# EAGLE design USB C breakout (EAGLE 9.6.2)
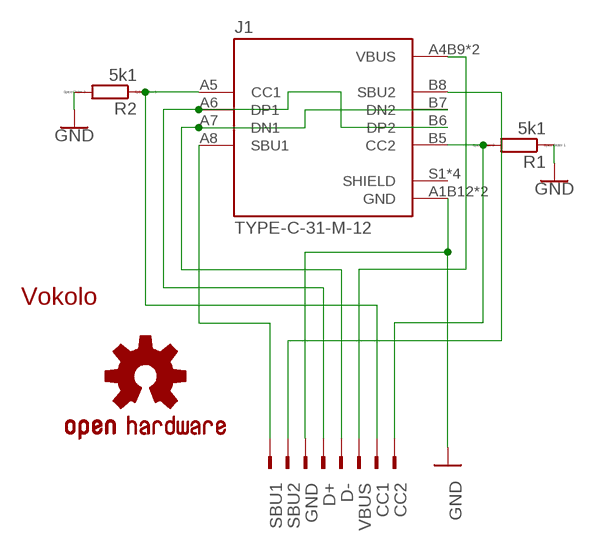
[diagram p0: schematic, sheet 1]

## Parts
J1  TYPE-C-31-M-12  [HRO_TYPE-C-31-M-12]
LOGO1  OSHW-LOGOS  [OSHW-LOGO-S]
R1  5k1  RR0603  [R0603]
R2  5k1  RR0603  [R0603]
U$1  LOGO_VOKOLO12MM  [LOGO_VOKOLO_9,8MM]
X1  TSW-108-07-G-S  [TSW-108-XX-G-S]

## Nets
CC1: J1.A5(CC1) R2.1 X1.2
CC2: J1.B5(CC2) R1.2 X1.1
D+: J1.A6(DP1) J1.B6(DP2) X1.5
D-: J1.A7(DN1) J1.B7(DN2) X1.4
GND: J1.A1B12(GND) J1.B1A12(GND) R1.1 R2.2 X1.6
SBU1: J1.A8(SBU1) X1.8
SBU2: J1.B8(SBU2) X1.7
VBUS: J1.A4B9(VBUS) J1.B4A9(VBUS) X1.3
Unconnected: J1.S1(SHIELD) J1.S2(SHIELD) J1.S3(SHIELD) J1.S4(SHIELD)

## Library data of the parts
J1 = TYPE-C-31-M-12:TYPE-C-31-M-12: USB Connectors 24 Receptacle 1 8.94*7.3mm RoHS Check prices <https://pricing.snapeda.com/parts/TYPE-C-31-M-12/HRO%20Electronics%20Co.%2C%20Ltd./view-part?ref=eda>; AVAILABILITY: No availability data; DESCRIPTION: USB Connectors 24 Receptacle 1 8.94*7.3mm RoHS; MF: HRO Electronics Co., Ltd.; MP: TYPE-C-31-M-12; PACKAGE: Package; PRICE: None
LOGO1 = SparkFun-Aesthetics:OSHW-LOGO: Open-Source Hardware (OSHW) Logo This logo indicates the piece of hardware it is found on incorporates a OSHW license and/or adheres to the definition of open source hardware found here: http://freedomdefined.org/OSHW
R1 R2 = eagle-ltspice:R: RESISTOR, European symbol; SPICEMODEL: NONE; SPICEPREFIX: R
U$1 = logo_vokolo:LOGO_VOKOLO: logo vokolo
X1 = con-samtec:TSW-108-*-G-S: THROUGH-HOLE .025" SQ POST HEADER Source: Samtec TSW.pdf; MF: Samtec Inc.; MPN: TSW-108-07-G-S

## Board
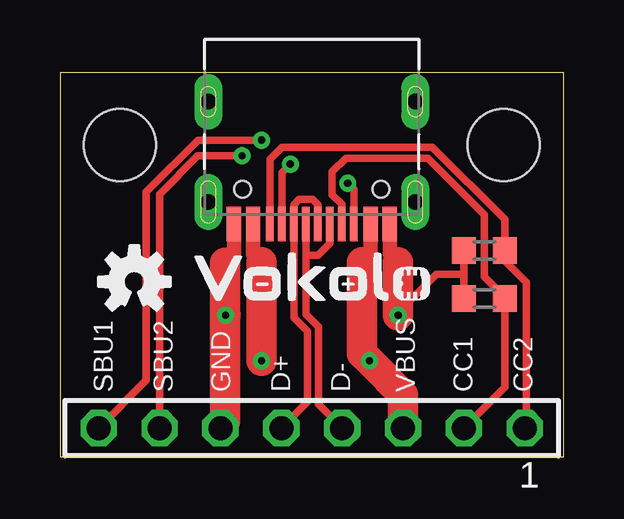
[diagram p1: board, top side]
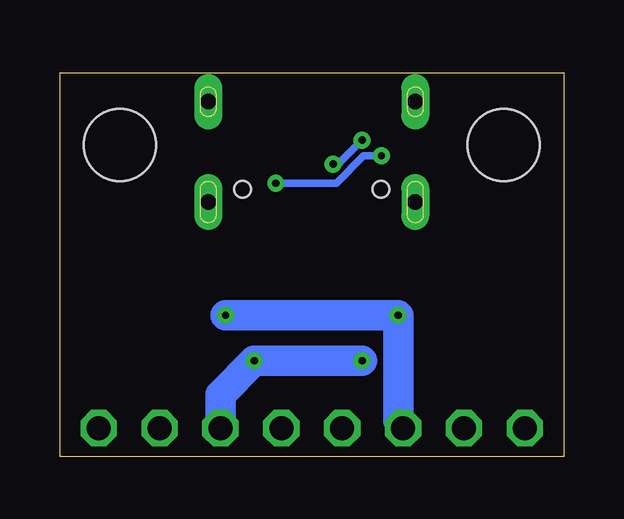
[diagram p2: board, bottom side, seen from below]

Size 21 x 16 mm. Coordinates in mm from the lower left corner, seen from the top.
Outline: 21,0 21,16 0,16 0,0 21,0
Copper layers (1*16): Top 0.035mm / dielectric 1.5mm / Bottom 0.035mm
Design rules "default": minimum track width 6mil, minimum drill 0.3mm, track to track 6mil, track to pad 6mil, pad to pad 6mil, via to via 6mil, smd to smd 6mil, copper to edge 20mil, drill to drill 6mil, minimum pad ring 10mil, minimum via ring 8mil, stop-mask expansion 4mil, vias tented up to drill 0.3mm, thermal gap 12mil
Holes 3 mm at 2.5,13 18.5,13

### Footprints (pad centres in the part's own frame; a part is rotated, then mirrored left to right if it is on the bottom)
HRO_TYPE-C-31-M-12 = smd 0.6 x 1.45: A1B12 -3.25,5.095; A4B9 -2.45,5.095; B1A12 3.25,5.095; B4A9 2.45,5.095 | smd 0.3 x 1.45: A5 -1.25,5.095; A6 -0.25,5.095; A7 0.25,5.095; A8 1.25,5.095; B5 1.75,5.095; B6 0.75,5.095; B7 -0.75,5.095; B8 -1.75,5.095 | drill 0.65 pad 1.05 long: S1 -4.32,4.18; S2 4.32,4.18; S3 -4.32,0; S4 4.32,0 | hole 0.7: -2.89,3.65; 2.89,3.65
R0603 = smd 1 x 1.1: 1 -0.85,0; 2 0.85,0
TSW-108-XX-G-S = drill 1 pad 1.5 octagon: 1 8.89,0; 2 6.35,0; 3 3.81,0; 4 1.27,0; 5 -1.27,0; 6 -3.81,0; 7 -6.35,0; 8 -8.89,0

### Placement (x,y rotation side)
J1  10.5,14.8 180 top
LOGO1  3.1,7.3 0 top
R1  17.7,8.6 0 top
R2  17.7,6.6 180 top
U$1  6.6,6.5 0 top
X1  10.5,1.2 0 top

### Tracks (layer width: path | path; a pad name or v marks a point on that pad's centre or on a via)
CC1
  Top 0.305: J1.A5 11.75,10.52 11.34,10.93 11.34,11.87 11.92,12.45 15.35,12.45 17.7,10.1 17.7,7.5 18.55,6.65 R2.1 18.55,2.9 X1.2
CC2
  Top 0.305: J1.B5 8.75,12.4 9.26,12.91 15.54,12.91 18.55,9.89 R1.2 18.55,8.18 19.45,7.28 19.45,1.26 X1.1
D+
  Top 0.305: J1.A6 10.75,10.51 10.53,10.73 9.97,10.73 9.75,10.51 J1.B6 9.75,5.8 10.33,5.23 10.33,2.3 X1.5
D-
  Top 0.305: J1.B7 11.25,8.9 10.75,8.4 10.25,8.4 | 10.25,8.4 10.25,5.95 10.79,5.42 10.79,2.19 X1.4 | 10.25,8.4 J1.A7
GND  (via drill 0.3)
  Top 0.305: R1.1 16.85,7.6 | 16.85,7.6 R2.2 16.75,6.5 | v14.1,5.9 14.1,6 15.7,7.6 16.85,7.6
  Top 0.61: J1.B1A12 7.25,8.45 6.9,8.1 | J1.A1B12 13.75,8.45 14.1,8.1
  Top 1.016: 6.9,8.1 6.89,8.09
  Top 1.27: 14.1,8.1 v14.1,5.9 | v6.89,5.89 6.89,1.5 6.69,1.3 X1.6 | v6.89,5.89 v6.9,5.9 | 6.89,8.09 v6.89,5.89
  Bottom 1.27: X1.6 6.69,1.3 6.89,1.5 v6.89,5.89 v6.9,5.9 v14.1,5.9
SBU1  (via drill 0.3)
  Top 0.305: J1.A8 9.25,11.84 v9.61,12.2 | X1.8 3.6,3.19 3.6,11.04 5.75,13.2 v8.4,13.2
  Bottom 0.305: v9.61,12.2 9.4,12.2 v8.4,13.2
SBU2  (via drill 0.3)
  Top 0.305: J1.B8 12.25,11.15 v12,11.4 | X1.7 4.15,10.95 5.74,12.54 v7.6,12.54
  Bottom 0.305: v7.6,12.54 8.34,12.54 9.48,11.4 v12,11.4
VBUS  (via drill 0.3)
  Top 0.61: J1.B4A9 8.05,8.45 8.4,8.1 | J1.A4B9 12.95,8.45 12.6,8.1
  Top 1.27: 8.4,8.1 v8.4,4 | 12.6,8.1 12.6,4.3 v12.9,4 14.31,2.59 X1.3
  Bottom 1.27: X1.3 14.31,2.59 v12.9,4 v8.4,4

### Text on the board
tNames: SBU1 | SBU2 | GND | D+ | D- | VBUS | CC1 | CC2